# EAGLE schematic Audio Amplifier (EAGLE 8.4.3)
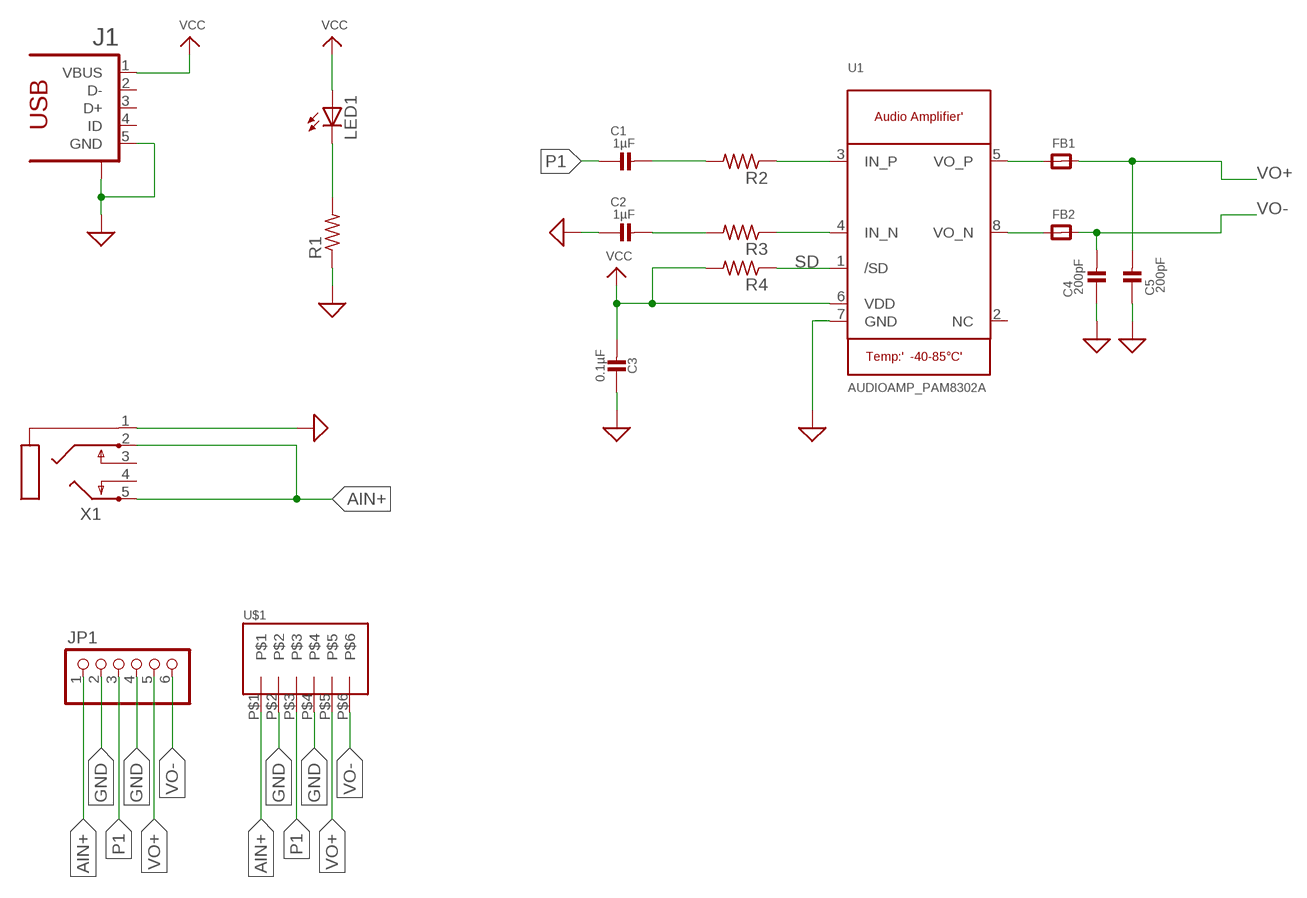
[diagram p0: schematic, sheet 1]

## Parts
C1  1µF  CAP_CERAMIC0805-NOOUTLINE  [0805-NO]
C2  1µF  CAP_CERAMIC0805-NOOUTLINE  [0805-NO]
C3  0.1µF  CAP_CERAMIC0805-NOOUTLINE  [0805-NO]
C4  200pF  CAP_CERAMIC0805-NOOUTLINE  [0805-NO]
C5  200pF  CAP_CERAMIC0805-NOOUTLINE  [0805-NO]
FB1  FERRITE_0805  [_0805]
FB2  FERRITE_0805  [_0805]
J1  1981584-1  [1981584-1]
JP1  PINHD-1X6  [1X06]
LED1  LEDCHIPLED_0603  [CHIPLED_0603]
R1  330Ω  R-US_R0603  [R0603]
R2  100Ω  R-US_R0603  [R0603]
R3  100Ω  R-US_R0603  [R0603]
R4  10KΩ  R-US_R0603  [R0603]
U1  AUDIOAMP_PAM8302A  [MSOP8_0.65MM]
U$1  90814-0806  [90814-0806]
X1  STEREOJACK  [STX3100]

## Nets
AIN+: JP1.1 U$1.P$1 X1.2 X1.5
GND: C2.1 C3.1 C4.1 C5.1 J1.5(GND) J1.S1 JP1.2 JP1.4 R1.1 U1.7(GND) U$1.P$2 U$1.P$4 X1.1 ; supply symbol labelled SUP
N$3: R3.1 U1.4(IN_N)
N$4: R2.1 U1.3(IN_P)
N$5: C1.2 R2.2
N$6: C2.2 R3.2
N$7: FB1.1 U1.5(VO_P)
N$8: FB2.1 U1.8(VO_N)
N$13: LED1.C R1.2
P1: C1.1 JP1.3 U$1.P$3
SD: R4.1 U1.1(/SD)
VCC: C3.2 J1.1(VBUS) LED1.A R4.2 U1.6(VDD)
VO+: C5.2 FB1.2 JP1.5 U$1.P$5
VO-: C4.2 FB2.2 JP1.6 U$1.P$6
Unconnected: J1.2(D-) J1.3(D+) J1.4(ID) U1.2(NC) X1.3 X1.4

## Library data of the parts
C1-C5 = audio amplifier example:CAP_CERAMIC
FB1 FB2 = audio amplifier example:FERRITE
J1 = audio amplifier example:1981584-1: Receptacle, micro-USB, type A/B Tyco Electronics
JP1 = audio amplifier example:PINHD-1X6: PIN HEADER
LED1 = audio amplifier example:LED
R1-R4 = audio amplifier example:R-US_: RESISTOR, American symbol
U1 = audio amplifier example:AUDIOAMP_PAM8302A: PAM8302A - 2.5W Class-D Mono Audio Amplifier MSOP8 = PAM8302AASCR
U$1 = audio amplifier example:90814-0806
X1 = audio amplifier example:STEREOJACK: MIC/HEADPHONE JACK Stereo jack with two switches. Kycon STX3100, CUI SJ1-3555NG and/or 4UCon 05544